# EAGLE design atmega32u4-aupannel (EAGLE 8.1.1)
CNAME: ATMEGA32U4-AU; CREVISION: Rev. 0; DESIGNER: German Gonzalez
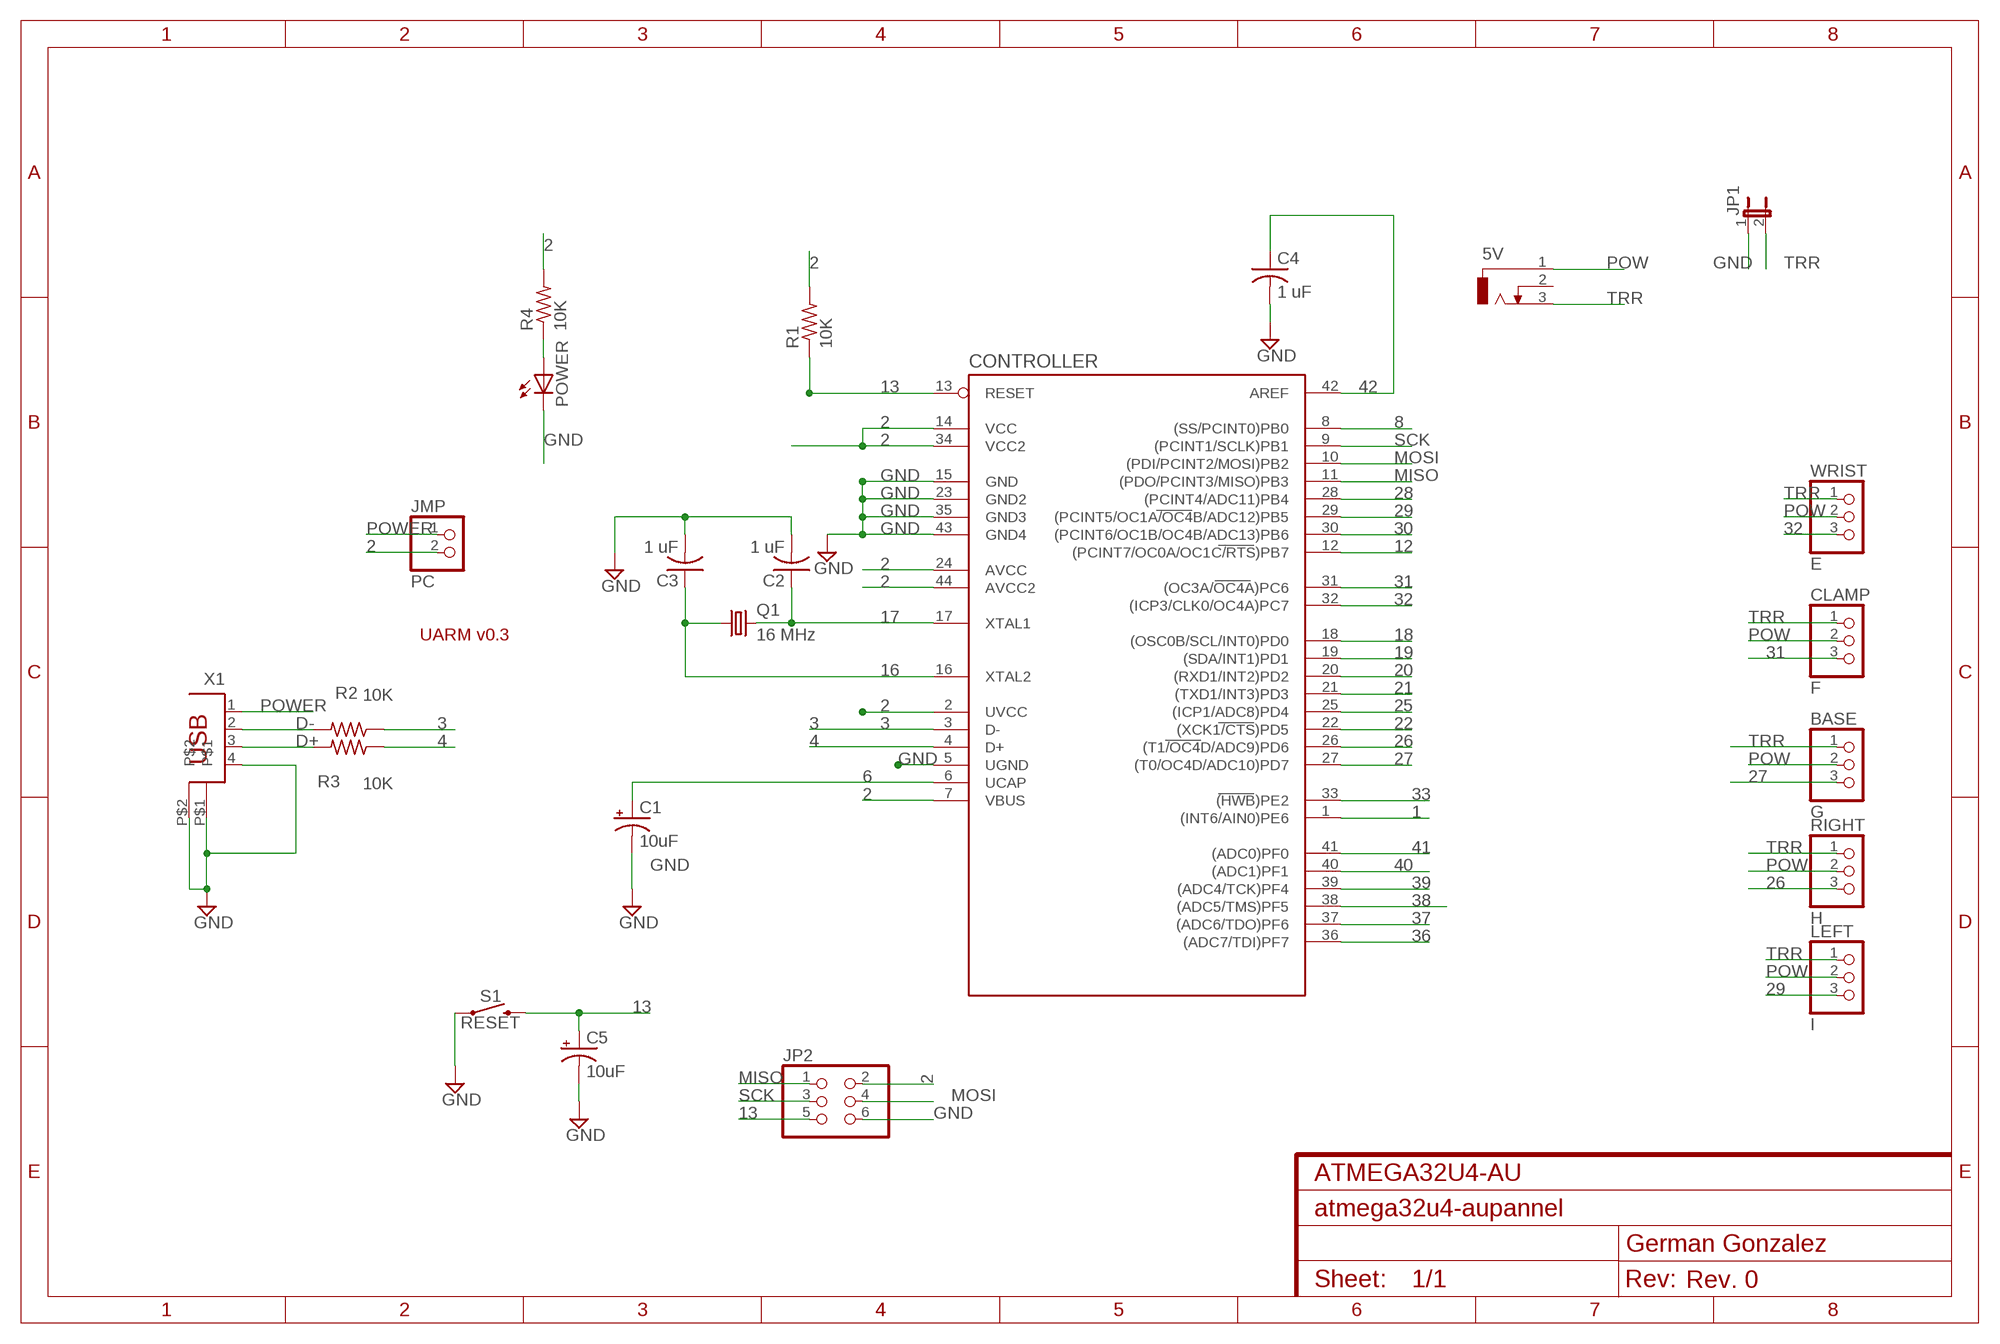
[diagram p0: schematic, sheet 1]

## Parts
5V  DCJ0202  [DCJ0202]
BASE  G  PINHD-1X3  [1X03]
C1  10uF  10UF-POLAR-RADIAL-2.5MM-KIT-25V-20%  [CPOL-RADIAL-2.5MM-5MM-KIT]
C2  1 uF  C-US025-024X044  [C025-024X044]
C3  1 uF  C-US025-024X044  [C025-024X044]
C4  1 uF  C-US025-024X044  [C025-024X044]
C5  10uF  10UF-POLAR-RADIAL-2.5MM-KIT-25V-20%  [CPOL-RADIAL-2.5MM-5MM-KIT]
CLAMP  F  PINHD-1X3  [1X03]
CONTROLLER  ATMEGA32U4-AU  [TQFP44]
JMP  PC  PINHD-1X2  [1X02]
JP1  JP1E  [JP1]
JP2  PINHD-2X3  [2X03]
LEFT  I  PINHD-1X3  [1X03]
POWER  LEDCHIPLED_0805  [CHIPLED_0805]
Q1  16 MHz  CRYSTALHC18U-V  [HC18U-V]
R1  10K  R-US_M0805  [M0805]
R2  10K  R-US_M0805  [M0805]
R3  10K  R-US_M0805  [M0805]
R4  10K  R-US_M0805  [M0805]
RIGHT  H  PINHD-1X3  [1X03]
S1  RESET  MOMENTARY-SWITCH-SPST-PTH-6.0MM  [TACTILE_SWITCH_PTH_6.0MM]
WRIST  E  PINHD-1X3  [1X03]
X1  PN61729  [PN61729]

## Nets
1: CONTROLLER.1((INT6/AIN0)PE6)
2: CONTROLLER.2(UVCC) CONTROLLER.7(VBUS) CONTROLLER.14(VCC) CONTROLLER.24(AVCC) CONTROLLER.34(VCC2) CONTROLLER.44(AVCC2) JMP.2 JP2.2 R1.2 R4.2
3: CONTROLLER.3(D-) R2.1
4: CONTROLLER.4(D+) R3.1
6: C1.1(+) CONTROLLER.6(UCAP)
8: CONTROLLER.8((SS/PCINT0)PB0)
12: CONTROLLER.12((PCINT7/OC0A/OC1C/RTS)PB7)
13: C5.1(+) CONTROLLER.13(RESET) JP2.5 R1.1 S1.3
16: C3.1 CONTROLLER.16(XTAL2) Q1.1
17: C2.1 CONTROLLER.17(XTAL1) Q1.2
18: CONTROLLER.18((OSC0B/SCL/INT0)PD0)
19: CONTROLLER.19((SDA/INT1)PD1)
20: CONTROLLER.20((RXD1/INT2)PD2)
21: CONTROLLER.21((TXD1/INT3)PD3)
22: CONTROLLER.22((XCK1/CTS)PD5)
25: CONTROLLER.25((ICP1/ADC8)PD4)
26: CONTROLLER.26((T1/OC4D/ADC9)PD6) RIGHT.3
27: BASE.3 CONTROLLER.27((T0/OC4D/ADC10)PD7)
28: CONTROLLER.28((PCINT4/ADC11)PB4)
29: CONTROLLER.29((PCINT5/OC1A/OC4B/ADC12)PB5) LEFT.3
30: CONTROLLER.30((PCINT6/OC1B/OC4B/ADC13)PB6)
31: CLAMP.3 CONTROLLER.31((OC3A/OC4A)PC6)
32: CONTROLLER.32((ICP3/CLK0/OC4A)PC7) WRIST.3
33: CONTROLLER.33((HWB)PE2)
36: CONTROLLER.36((ADC7/TDI)PF7)
37: CONTROLLER.37((ADC6/TDO)PF6)
38: CONTROLLER.38((ADC5/TMS)PF5)
39: CONTROLLER.39((ADC4/TCK)PF4)
40: CONTROLLER.40((ADC1)PF1)
41: CONTROLLER.41((ADC0)PF0)
42: C4.1 CONTROLLER.42(AREF)
D+: R3.2 X1.3
D-: R2.2 X1.2
GND: C1.2(-) C2.2 C3.2 C4.2 C5.2(-) CONTROLLER.5(UGND) CONTROLLER.15(GND) CONTROLLER.23(GND2) CONTROLLER.35(GND3) CONTROLLER.43(GND4) JP1.1 JP2.6 POWER.C S1.1 X1.4 X1.P$1 X1.P$2
MISO: CONTROLLER.11((PDO/PCINT3/MISO)PB3) JP2.1
MOSI: CONTROLLER.10((PDI/PCINT2/MOSI)PB2) JP2.4
N$1: POWER.A R4.1
POW [supply]: 5V.1 BASE.2 CLAMP.2 LEFT.2 RIGHT.2 WRIST.2
POWER: JMP.1 X1.1
SCK: CONTROLLER.9((PCINT1/SCLK)PB1) JP2.3
TRR [supply]: 5V.3 BASE.1 CLAMP.1 JP1.2 LEFT.1 RIGHT.1 WRIST.1
Unconnected: 5V.2

## Notes on the sheet
- UARM v0.3

## Library data of the parts
5V = con-jack:DCJ0202: DC POWER JACK Source: DCJ0202.pdf; OC_FARNELL: unknown; OC_NEWARK: unknown
BASE CLAMP LEFT RIGHT WRIST = pinhead:PINHD-1X3: PIN HEADER
C1 C5 = SparkFun-Capacitors:10UF-POLAR: 10.0µF polarized capacitors A capacitor is a passive two-terminal electrical component used to store electrical energy temporarily in an electric field.; PROD_ID: CAP-08440
C2-C4 = resistor:C-US: CAPACITOR, American symbol
CONTROLLER = mega32U4:ATMEGA32U4-AU
JMP = pinhead:PINHD-1X2: PIN HEADER
JP1 = jumper:JP1E: JUMPER
JP2 = pinhead:PINHD-2X3: PIN HEADER
POWER = adafruit:LED: LED OSRAM: - CHIPLED LG R971, LG N971, LY N971, LG Q971, LY Q971, LO R971, LY R971 LH N974, LH R974 LS Q976, LO Q976, LY Q976 LO Q996 - Hyper CHIPLED LW Q18S LB Q993, LB Q99A, LB R99A - SideLED LS A670, LO A670, LY A670, LG A670, LP A670 LB A673, LV A673, LT A673, LW A673 LH A674 LY A675 LS A676, LA A676, LO A676, LY A676, LW A676 LS A679, LY A679, LG A679 - Hyper Micro SIDELED® LS Y876, LA Y876, LO Y876, LY Y876 LT Y87S - SmartLED LW L88C, LW L88S LB L89C, LB L89S, LG L890 LS L89K, LO L89K, LY L89K LS L896, LA L896, LO L896, LY L896 - TOPLED LS T670, LO T670, LY T670, LG T670, LP T670 LSG T670, LSP T670, LSY T670, LOP T670, LYG T670 LG T671, LOG T671, LSG T671 LB T673, LV T673, LT T673, LW T673 LH T674 LS T676, LA T676, LO T676, LY T676, LB T676, LH T676, LSB T676, LW T676 LB T67C, LV T67C, LT T67C, LS T67K, LO T67K, LY T67K, LW E67C LS E67B, LA E67B, LO E67B, LY E67B, LB E67C, LV E67C, LT E67C LW T67C LS T679, LY T679, LG T679 LS T770, LO T770, LY T770, LG T770, LP T770 LB T773, LV T773, LT T773, LW T773 LH T774 LS E675, LA E675, LY E675, LS T675 LS T776, LA T776, LO T776, LY T776, LB T776 LHGB T686 LT T68C, LB T68C - Hyper Mini TOPLED® LB M676 - Mini TOPLED Santana® LG M470 LS M47K, LO M47K, LY M47K Source: http://www.osram.convergy.de/
Q1 = crystal:CRYSTAL: CRYSTAL; OC_FARNELL: unknown; OC_NEWARK: unknown
R1-R4 = resistor:R-US_: RESISTOR, American symbol
S1 = SparkFun-Switches:MOMENTARY-SWITCH-SPST: Momentary Switch (Pushbutton) - SPST Normally-open (NO) SPST momentary switches (buttons, pushbuttons). Variants PTH-12MM - 12mm square, through-hole Momentary Pushbutton Switch - 12mm Square <https://www.sparkfun.com/products/9190> (COM-09190) PTH-6.0MM, PTH-6.0MM-KIT - 6.0mm square, through-hole Mini Pushbutton Switch <https://www.sparkfun.com/products/97> (COM-00097) KIT package intended for soldering kit's - only one side of pads' copper is exposed. PTH-RIGHT-ANGLE-KIT - Right-angle, through-hole Right Angle Tactile Button <https://www.sparkfun.com/products/10791> - Used on SparkFun BigTime Watch Kit <https://www.sparkfun.com/products/11734> SMD-12MM - 12mm square, surface-mount Tactile Button - SMD (12mm) <https://www.sparkfun.com/products/12993> (COM-12993) Used on SparkFun PicoBoard <https://www.sparkfun.com/products/11888> SMD-4.5MM - 4.5mm Square Trackball Switch Used on SparkFun Blackberry Trackballer Breakout <https://www.sparkfun.com/products/13169> SMD-4.6MMX2.8MM - 4.60mm x 2.80mm, surface mount Used on SparkFun SAMD21 Mini Breakout <https://www.sparkfun.com/products/13664> SMD-5.2MM, SMD-5.2-REDUNDANT - 5.2mm square, surface-mount Mini Pushbutton Switch - SMD <https://www.sparkfun.com/products/8720> (COM-08720) Used on Arduino Pro Mini <https://www.sparkfun.com/products/11114> REDUNDANT package connects both switch circuits together SMD-6.0X3.5MM - 6.0 x 3.5mm, surface mount Momentary Reset Switch SMD <https://www.sparkfun.com/products/8229> (COM-08229) SMD-6.2MM-TALL - 6.2mm square, surface mount Tactile Button - SMD (6mm) <https://www.sparkfun.com/products/12992> Used on SparkFun Digital Sandbox <https://www.sparkfun.com/products/12651> SMD-RIGHT-ANGLE - Right-angle, surface mount Used on SparkFun Block for Intel® Edison - Arduino <https://www.sparkfun.com/products/13036>; PROD_ID: SWCH-08441; SF_SKU: COM-00097
X1 = SmartPrj:PN61729: BERG USB connector

## Net classes
0 default: width 0.254 mm
1 supply: width 0.66 mm

## Board
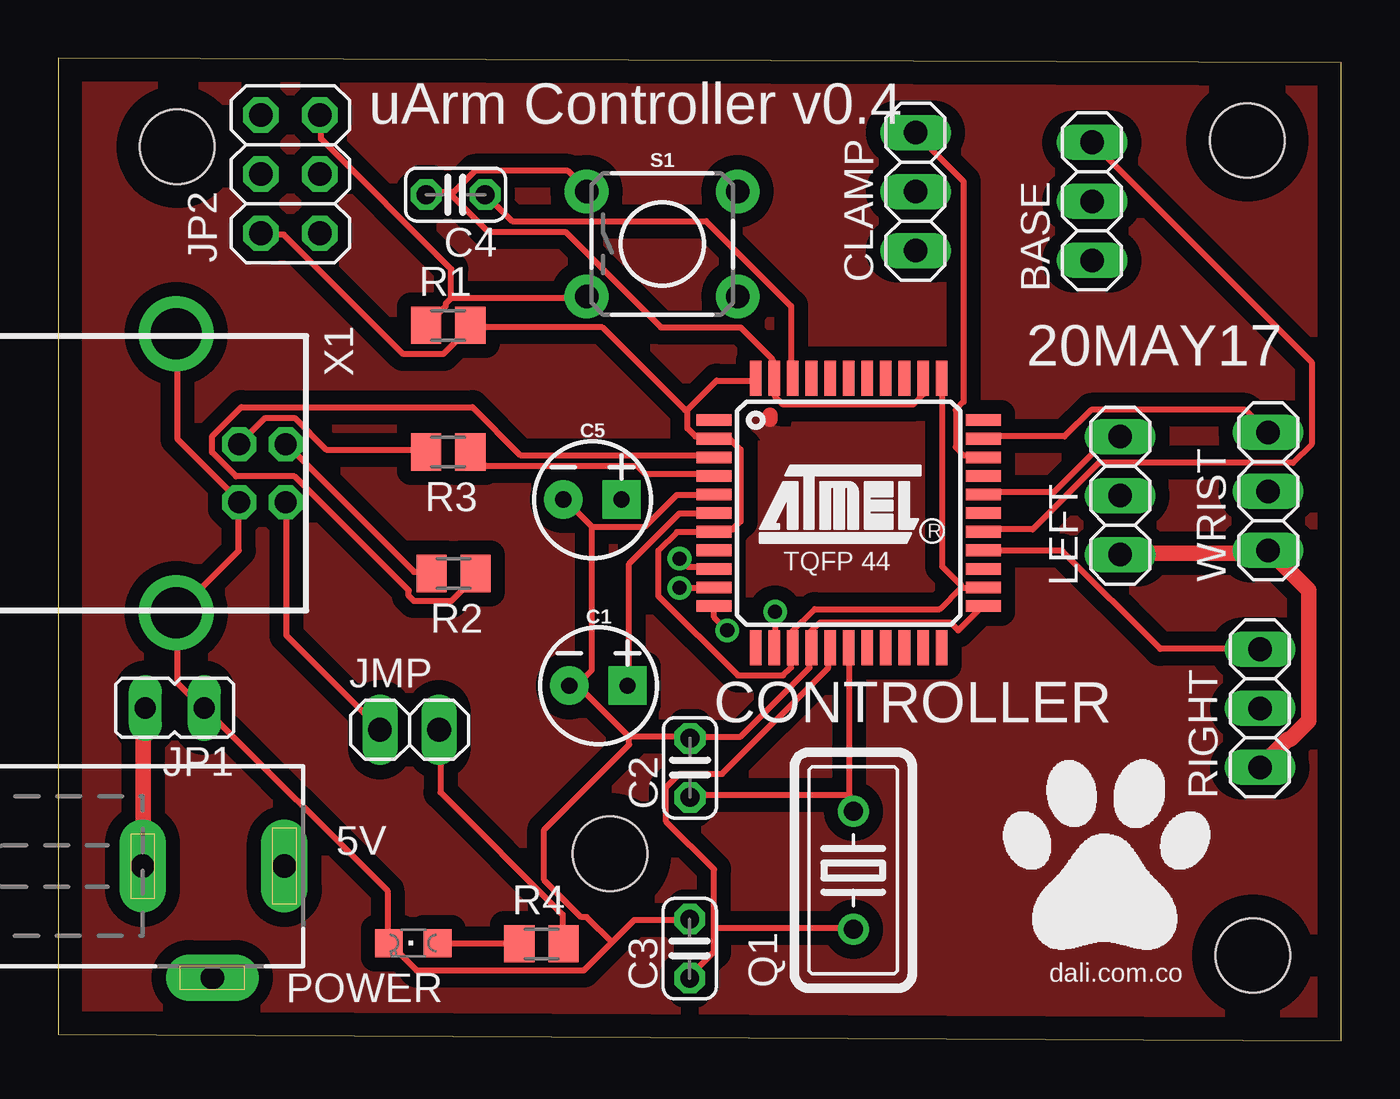
[diagram p1: board, top side]
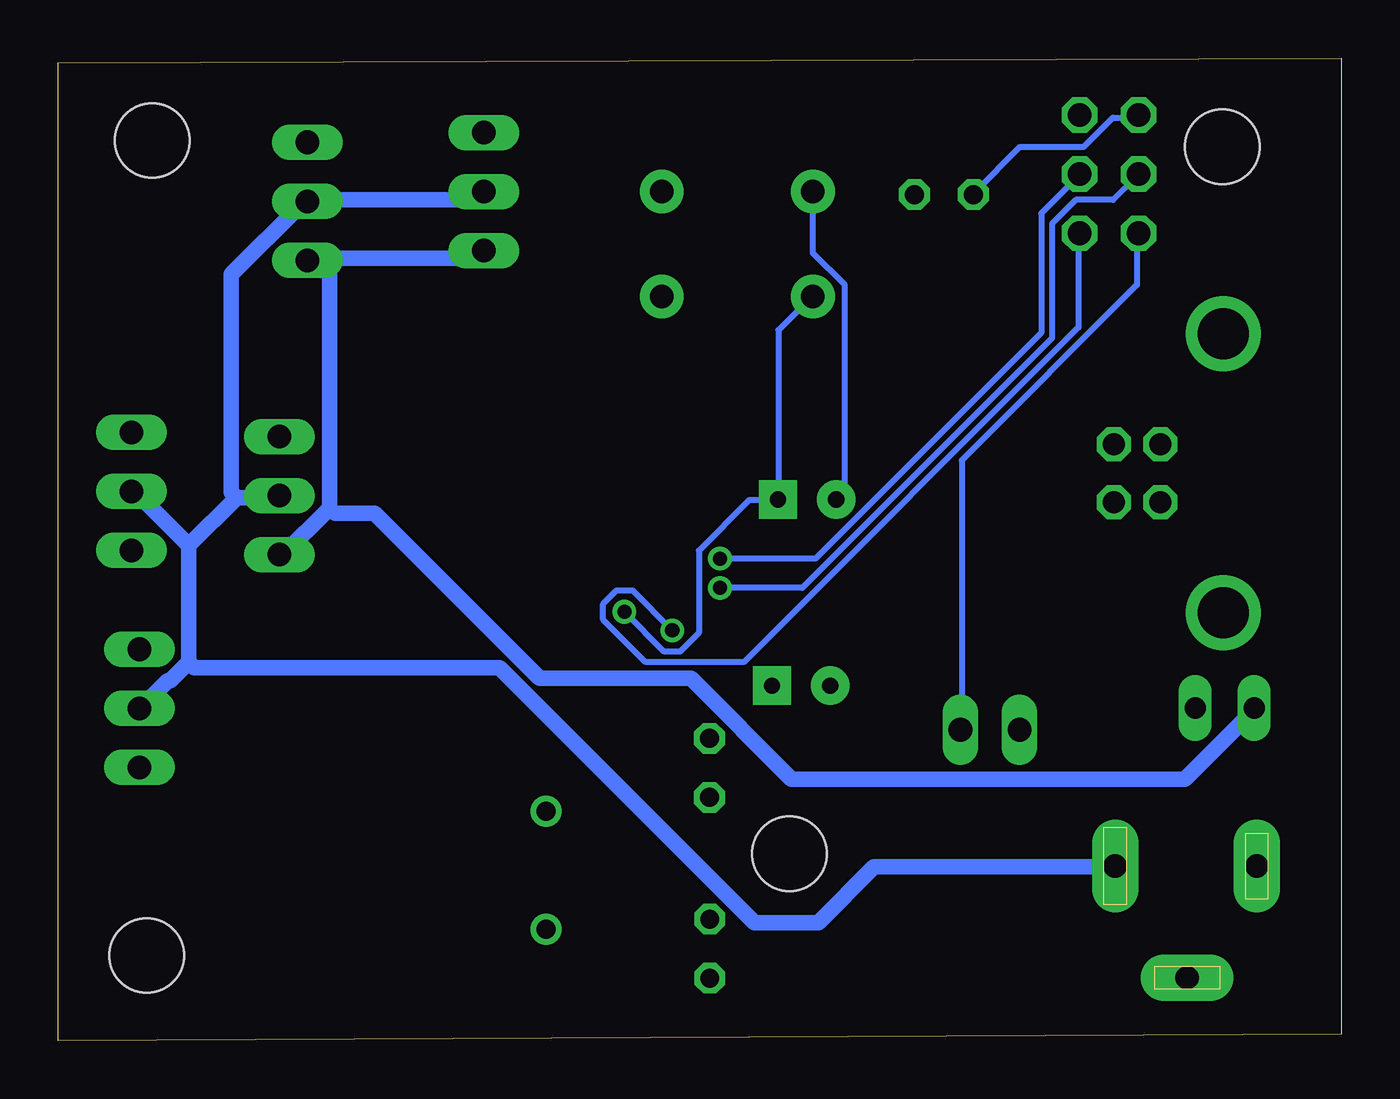
[diagram p2: board, bottom side, seen from below]

Size 55.24 x 42.27 mm. Coordinates in mm from the lower left corner, seen from the top.
Outline: 0,0.27 55.24,0 55.24,42.07 0,42.27 0,0.27
Copper layers (1*16): Top 0.035mm / dielectric 1.5mm / Bottom 0.035mm
Design rules "default": minimum track width 10mil, minimum drill 24mil, track to track 8mil, track to pad 8mil, pad to pad 8mil, via to via 8mil, smd to smd 8mil, copper to edge 40mil, drill to drill 8mil, minimum pad ring 10mil, minimum via ring 8mil, stop-mask expansion 4mil, vias tented up to drill 0mil, thermal gap 10mil
Holes 3.2 mm at 5.13,38.46 51.19,38.72 51.42,3.65 23.75,8.03

### Footprints (pad centres in the part's own frame; a part is rotated, then mirrored left to right if it is on the bottom)
DCJ0202 = drill 1 pad 2 long: 1 0,3.1; 2 4.8,0; 3 0,-3
1X03 = drill 1.016 long: 1 -2.54,0; 2 0,0; 3 2.54,0
CPOL-RADIAL-2.5MM-5MM-KIT = drill 0.7 pad 1.651 square: 1 1.25,0 | drill 0.7 pad 1.651: 2 -1.25,0
C025-024X044 = drill 0.813 octagon: 1 -1.27,0; 2 1.27,0
TQFP44 = smd 1.5 x 0.5: 1 -5.8,4; 2 -5.8,3.2; 3 -5.8,2.4; 4 -5.8,1.6; 5 -5.8,0.8; 6 -5.8,0; 7 -5.8,-0.8; 8 -5.8,-1.6; 9 -5.8,-2.4; 10 -5.8,-3.2; 11 -5.8,-4; 23 5.8,-4; 24 5.8,-3.2; 25 5.8,-2.4; 26 5.8,-1.6; 27 5.8,-0.8; 28 5.8,0; 29 5.8,0.8; 30 5.8,1.6; 31 5.8,2.4; 32 5.8,3.2; 33 5.8,4 | smd 0.5 x 1.5: 12 -4,-5.8; 13 -3.2,-5.8; 14 -2.4,-5.8; 15 -1.6,-5.8; 16 -0.8,-5.8; 17 0,-5.8; 18 0.8,-5.8; 19 1.6,-5.8; 20 2.4,-5.8; 21 3.2,-5.8; 22 4,-5.8; 34 4,5.8; 35 3.2,5.8; 36 2.4,5.8; 37 1.6,5.8; 38 0.8,5.8; 39 0,5.8; 40 -0.8,5.8; 41 -1.6,5.8; 42 -2.4,5.8; 43 -3.2,5.8; 44 -4,5.8
1X02 = drill 1.016 long: 1 -1.27,0; 2 1.27,0
JP1 = drill 0.914 long: 1 0,-1.27; 2 0,1.27
2X03 = drill 1.016 octagon: 1 -2.54,-1.27; 2 -2.54,1.27; 3 0,-1.27; 4 0,1.27; 5 2.54,-1.27; 6 2.54,1.27
CHIPLED_0805 = smd 1.2 x 1.2: A 0,-1.05; C 0,1.05
HC18U-V = drill 0.813: 1 -2.54,0; 2 2.54,0
M0805 = smd 1.3 x 1.6: 1 -0.95,0; 2 0.95,0
TACTILE_SWITCH_PTH_6.0MM = drill 1.016 pad 1.88: 1 -3.251,2.261; 2 3.251,2.261; 3 -3.251,-2.261; 4 3.251,-2.261
PN61729 = drill 0.95 octagon: 1 1.25,4.71; 2 -1.25,4.71; 3 -1.25,2.71; 4 1.25,2.71 | drill 2.2: P$1 -6,0; P$2 6,0

### Placement (x,y rotation side)
5V  6.64,7.5 270 top
BASE  44.5,36.11 90 top
C1  23.26,15.27 0 top
C2  27.2,11.73 90 top
C3  27.19,3.95 90 top
C4  17.11,36.4 180 top
C5  23,23.27 0 top
CLAMP  36.91,36.52 90 top
CONTROLLER  34.03,22.69 0 top
JMP  15.13,13.37 0 top
JP1  5.02,14.31 90 top
JP2  10,37.27 90 top
LEFT  45.71,23.45 90 top
POWER  15.29,4.19 90 top
Q1  34.23,7.33 90 top
R1  16.79,30.77 0 top
R2  17.02,20.09 180 top
R3  16.79,25.32 180 top
R4  20.81,4.16 0 top
RIGHT  51.73,14.29 90 top
S1  26,34.27 0 top
U$1  [DALI]  40.69,3.92 0 top
WRIST  52.08,23.63 90 top
X1  5.08,24.4 270 top

### Tracks (layer width: path | path; a pad name or v marks a point on that pad's centre or on a via)
2
  Top 0.254: R4.2 21.72,4.16 21.72,5.42 16.46,10.68 16.46,13.3 JMP.2 | 27.09,27.13 28.35,28.39 29.95,28.39 CONTROLLER.44 | 27.09,27.13 27.09,26.33 27.43,25.99 28.12,25.99 CONTROLLER.2 28.23,25.88 28.92,25.88 29.38,25.42 29.38,22.33 29.03,21.99 28.23,21.99 CONTROLLER.7 28.12,21.88 26.63,21.88 25.83,21.08 25.83,19.13 29.26,15.71 31.2,15.71 31.55,16.05 31.55,16.85 CONTROLLER.14 31.55,16.96 31.55,17.53 32.58,18.56 37.95,18.56 38.86,19.48 | 38.86,19.48 39.78,19.48 CONTROLLER.24 | CONTROLLER.34 38.06,28.39 38.06,20.39 38.86,19.59 38.86,19.48 | 27.09,27.13 26.98,27.13 23.43,30.68 17.83,30.68 R1.2 17.72,30.68 16.57,29.54 14.86,29.54 9.72,34.68 8.8,34.68 JP2.2
  Bottom 0.254: JMP.2 16.35,13.42 16.35,24.96 8.8,32.51 8.8,34.68 JP2.2
3
  Top 0.254: CONTROLLER.3 28.12,25.19 19.89,25.19 17.83,27.25 7.89,27.25 6.63,25.99 6.63,25.31 7.66,24.28 10.17,24.28 15.09,19.36 15.09,19.13 15.32,18.91 16.92,18.91 18.06,20.05 R2.1
4
  Top 0.254: CONTROLLER.4 28.12,24.39 25.26,24.39 24.92,24.73 18.4,24.73 17.83,25.31 R3.1
6
  Top 0.254: CONTROLLER.6 28.12,22.68 26.75,22.68 24.58,20.51 24.58,15.36 C1.1
13  (via drill 0.61)
  Top 0.254: v30.86,18.45 30.86,16.96 CONTROLLER.13 | 16.92,31.94 16.69,31.71 16.69,31.59 15.89,30.79 R1.1 | 16.92,31.94 22.75,31.94 S1.3 | 16.92,31.94 16.92,33.19 11.32,38.79 11.32,39.71 JP2.5
  Bottom 0.254: v30.86,18.45 29.15,16.73 28.46,16.73 27.66,17.53 27.66,21.08 25.49,23.25 24.35,23.25 C5.1 24.23,23.36 24.23,30.56 22.86,31.94 S1.3
16
  Top 0.254: 28.23,4.85 28.23,3.82 27.2,2.79 C3.1 | 28.23,4.85 28.23,7.36 26.18,9.42 26.18,10.9 26.75,11.48 28.58,11.48 33.15,16.05 33.15,16.85 CONTROLLER.16 | 28.23,4.85 34.18,4.85 Q1.1
17
  Top 0.254: 34.06,10.56 34.06,9.99 34.18,9.88 Q1.2 | 34.06,10.56 34.06,16.85 CONTROLLER.17 | 34.06,10.56 27.2,10.56 C2.1
26
  Top 0.254: CONTROLLER.26 39.89,21.08 43.21,21.08 47.43,16.85 51.66,16.85 RIGHT.3
27
  Top 0.254: CONTROLLER.27 39.89,21.99 41.95,21.99 44.81,24.85 53.15,24.85 53.95,25.65 53.95,29.19 44.58,38.57 BASE.3
29
  Top 0.254: CONTROLLER.29 39.89,23.59 42.86,23.59 45.15,25.88 45.61,25.88 LEFT.3
31
  Top 0.254: CONTROLLER.31 39.78,25.19 38.98,25.19 38.63,25.53 38.63,27.13 38.98,27.48 38.98,36.96 36.92,39.02 CLAMP.3
32
  Top 0.254: CONTROLLER.32 39.89,25.99 43.32,25.99 44.46,27.13 51.09,27.13 52.01,26.22 WRIST.3
42
  Top 0.254: CONTROLLER.42 31.55,28.51 31.55,31.59 27.89,35.25 19.55,35.25 18.4,36.39 C4.1
D+
  Top 0.254: R3.2 15.77,25.42 11.54,25.42 10.17,26.79 8.92,26.79 7.89,25.76 X1.3
D-
  Top 0.254: R2.2 16,20.16 15.32,20.16 9.83,25.65 X1.2
GND
  Top 0.254: CONTROLLER.35 37.26,28.39 37.26,27.82 36.81,27.36 31.2,27.36 30.86,27.71 30.86,28.39 CONTROLLER.43 30.75,28.51 30.75,29.31 29.38,30.68 25.95,30.68 21.83,34.79 18.52,34.79 16.92,36.39 16.92,36.51 | 16.92,36.51 17.03,36.51 17.95,37.42 21.95,37.42 22.75,36.62 S1.1 | 16.92,36.51 15.89,36.51 C4.2 | 22.97,22.11 25.26,22.11 26.63,23.48 28.12,23.48 CONTROLLER.5 | 22.97,22.11 21.83,23.25 C5.2 | CONTROLLER.23 39.78,18.68 38.75,17.65 38.41,17.99 32.8,17.99 32.35,17.53 32.35,16.96 CONTROLLER.15 32.35,16.85 32.35,16.05 29.38,13.08 27.2,13.08 C2.2 27.09,13.08 24.58,13.08 | 24.58,13.08 22.4,15.25 22.06,15.25 C1.2 22.4,15.36 22.97,15.93 22.97,22.11 | X1.P$1 5.14,30.34 5.14,25.88 7.77,23.25 X1.4 7.77,23.13 7.77,21.08 5.14,18.45 X1.P$2 5.14,18.33 5.14,15.36 6.17,14.33 JP1.1 6.4,14.22 14.17,6.45 14.17,4.27 POWER.C 14.29,4.16 15.43,3.02 22.63,3.02 23.83,4.22 | 23.83,4.22 24.8,5.19 27.09,5.19 C3.2 | 24.58,13.08 24.58,12.73 20.92,9.08 20.92,6.9 22.52,5.3 22.75,5.3 23.83,4.22
  Bottom 0.254: JP2.6 8.8,39.71 9.83,39.71 11.09,38.45 13.83,38.45 15.77,36.51 C4.2 | S1.1 22.75,36.51 22.75,33.88 21.37,32.51 21.37,23.71 21.72,23.36 C5.2
MISO  (via drill 0.61)
  Top 0.254: v28.8,17.65 28.23,18.22 28.23,18.68 CONTROLLER.11
  Bottom 0.254: v28.8,17.65 30.52,19.36 31.2,19.36 31.78,18.79 31.78,18.11 29.95,16.28 25.72,16.28 11.32,30.68 11.32,34.68 JP2.1
MOSI  (via drill 0.61)
  Top 0.254: v26.75,19.48 28.12,19.48 CONTROLLER.10
  Bottom 0.254: v26.75,19.48 23.2,19.48 12.46,30.22 12.46,35.14 11.43,36.16 9.83,36.16 8.8,37.19 JP2.4
N$1
  Top 0.254: POWER.A 16.35,4.16 19.77,4.16 R4.1
N$3
  pour Top (isolate 0.61): 0,42.27 55,42.27 55,0.27 0,0.27
NS$
  Top 0.66: 30.63,26.91 30.63,26.73
  pour Top (isolate 0.813): 0.03,42.13 55.21,42.13 54.58,0.27 0,0.27
POW
  Bottom 0.66: CLAMP.2 36.92,36.51 37.26,36.16 44.46,36.16 BASE.2 44.81,35.94 47.78,32.96 47.78,23.59 47.55,23.36 | 49.61,16.28 50.41,15.48 50.52,15.48 51.66,14.33 RIGHT.2 | 49.61,21.31 49.61,16.28 | 49.61,21.31 52.01,23.71 WRIST.2 | 47.55,23.36 45.72,23.36 LEFT.2 | 49.61,21.31 47.55,23.36 | 5V.1 9.83,7.48 20.12,7.48 22.52,5.08 25.26,5.08 36.23,16.05 49.38,16.05 49.61,16.28
POWER
  Top 0.254: X1.1 9.83,23.13 9.83,17.42 13.83,13.42 JMP.1
SCK  (via drill 0.61)
  Top 0.254: v26.75,20.73 27.09,20.39 28.12,20.39 CONTROLLER.9
  Bottom 0.254: v26.75,20.73 22.63,20.73 12.92,30.45 12.92,35.59 11.32,37.19 JP2.3
TRR
  Top 0.66: JP1.2 3.66,14.22 3.66,7.59 5V.3 | RIGHT.1 51.78,11.82 52.92,12.96 53.04,12.96 53.84,13.76 53.84,19.36 52.12,21.08 WRIST.1 51.78,20.96 45.72,20.96 LEFT.1
  Bottom 0.66: CLAMP.1 36.92,33.88 37.15,33.65 44.46,33.65 BASE.1 43.55,33.42 43.55,22.91 | 43.55,22.91 45.61,20.85 LEFT.1 | JP1.2 3.77,14.22 6.74,11.25 23.66,11.25 28,15.59 34.52,15.59 41.61,22.68 43.32,22.68 43.55,22.91

### Text on the board
tPlace: uArm Controller v0.4 | 20MAY17